# Altium schematic sheet S-COMERCIALES.SchDoc: SENSORES COMERCIALES
size A3; ApprovedBy: ---; Author: MARIO DE MIGUEL; SheetNumber: 4; SheetTotal: 7; ProjectTitle: SENSACIONAL 2
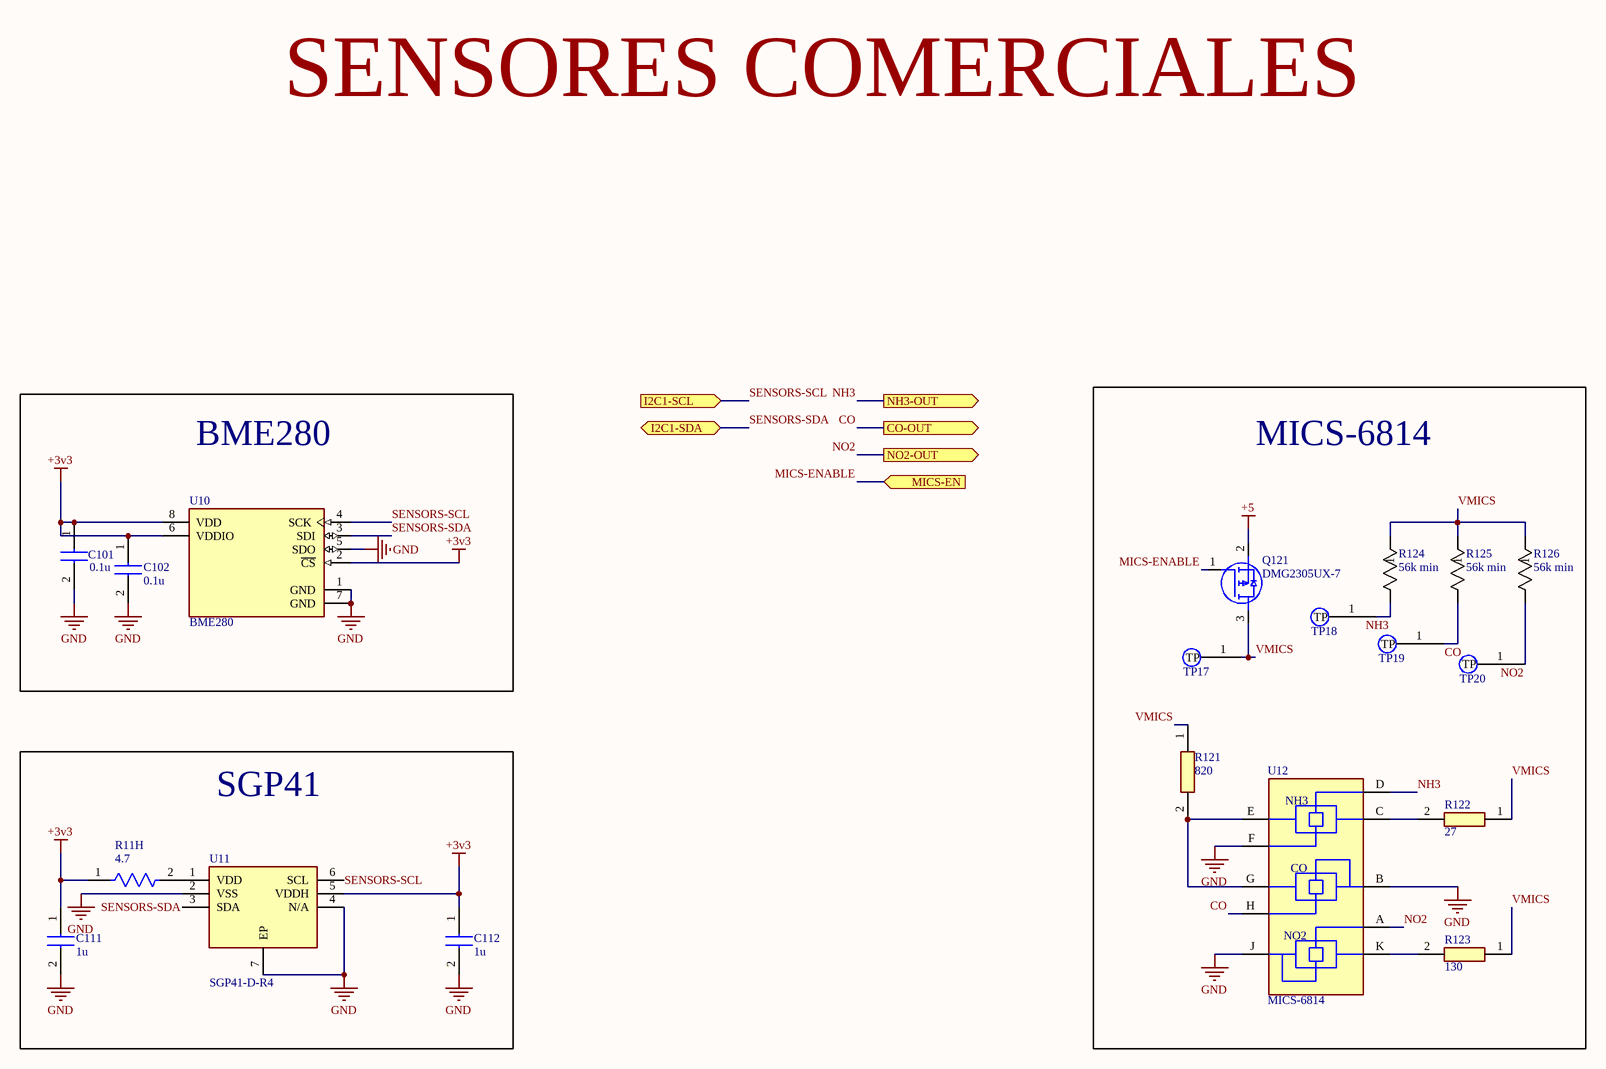
[diagram p0: S-COMERCIALES.SchDoc]

## Parts
C101  0.1u  [CAPC1005X22N]
C102  0.1u  [CAPC1005X22N]
C111  1u  [GRM15x]
C112  1u  [GRM15x]
Q121  DMG2305UX-7  [SOT96P240X115-3N]
R11H  4.7  [FP-AF0402-MFG]
R121  820  [RESC2012X70N]
R122  27  [ERJUP6]
R123  130  [ERJUP6]
R124  56k min  [RES_CFR25_6P3X2P4_YAG]  (no BOM)
R125  56k min  [RES_CFR25_6P3X2P4_YAG]  (no BOM)
R126  56k min  [RES_CFR25_6P3X2P4_YAG]  (no BOM)
TP17  Testpoint  [Testpoint_TH]  (value not drawn)  (no BOM)
TP18  Testpoint  [Testpoint_TH]  (value not drawn)  (no BOM)
TP19  Testpoint  [Testpoint_TH]  (value not drawn)  (no BOM)
TP20  Testpoint  [Testpoint_TH]  (value not drawn)  (no BOM)
U10  BME280  [FP-BME280-MFG]
U11  SGP41-D-R4  [SON80P244X244X95-7N]
U12  MICS-6814  [FP-MICS-6814-MFG]

## Blocks framed on the sheet
BME280: C101 C102 U10
MICS-6814: Q121 R121-R126 TP17-TP20 U12
SGP41: C111 C112 R11H U11

## Ports
CO-OUT (out), I2C1-SCL (in), I2C1-SDA (bidir), MICS-EN (in), NH3-OUT (out), NO2-OUT (out)

## Nets
+3v3: C101.1 C102.1 C111.1 C112.1 R11H.1 U10.2(~{CS}) U10.6(VDDIO) U10.8(VDD) U11.5(VDDH)
+5: Q121.2(S)
GND: C101.2 C102.2 C111.2 C112.2 U10.1(GND) U10.5(SDO) U10.7(GND) U11.2(VSS) U11.4(N/A) U11.7(EP) U12.B(Rh1_RED/Rs1_RED) U12.F(Rs2_NH3) U12.J(Rh1_OX/Rs1_OX)
CO: R125.2 TP19.1(TP) U12.H(Rs2_RED) ; port CO-OUT
MICS-ENABLE: Q121.1(G) ; port MICS-EN
NH3: R124.2 TP18.1(TP) U12.D(Rs1_NH3) ; port NH3-OUT
NO2: R126.2 TP20.1(TP) U12.A(Rs2) ; port NO2-OUT
SENSORS-SCL: U10.4(SCK) U11.6(SCL) ; port I2C1-SCL
SENSORS-SDA: U10.3(SDI) U11.3(SDA) ; port I2C1-SDA
VMICS: Q121.3(D) R121.1 R122.1 R123.1 R124.1 R125.1 R126.1 TP17.1(TP)
NetR11H_2: R11H.2 U11.1(VDD)
NetR121_2: R121.2 U12.E(Rh2_NH3) U12.G(Rh2_RED)
NetR122_2: R122.2 U12.C(Rh1_NH3)
NetR123_2: R123.2 U12.K(Rh2_OX)

## Notes on the sheet
- SENSORES COMERCIALES
- Title:
- Author:
- Approved:
- Size:
- Date:
- Git Hash:
- A3
- Prj:
- SW Version:
- Variant:
- Edited:
- CERN-OHL-S-2.0
- File:
- (in symbol CMP-02321-000001-1) NH3; CO; NO2

## Library data of the parts
C101 C102 = GRM152R61A104KE19D: Capacitor; Manufacturer_Name: Murata Electronics; Datasheet Link: https://search.murata.co.jp/Ceramy/image/img/A01X/G101/ENG/GRM152R61A104KE19-01A.pdf; Height: 0.22mm; Manufacturer_Part_Number: GRM152R61A104KE19D; Mouser Part Number: 81-GRM152R61A104KE9D; Mouser Price/Stock: https://www.mouser.co.uk/ProductDetail/Murata-Electronics/GRM152R61A104KE19D?qs=IPQhFcwEUOjgOs7G%2Fz457g%3D%3D; Arrow Part Number: GRM152R61A104KE19D; Arrow Price/Stock: https://www.arrow.com/en/products/grm152r61a104ke19d/murata-manufacturing
C111 C112 = GRM155C71C105ME11J: Capacitor; Manufacturer_Name: Murata Electronics; Datasheet Link: https://search.murata.co.jp/Ceramy/image/img/A01X/G101/ENG/GRM155C71C105ME11-01A.pdf; Height: 0.33mm; Manufacturer_Part_Number: GRM155C71C105ME11J
Q121 = DMG2305UX-7: MOSFET (P-Channel); Manufacturer_Name: Diodes Incorporated; Datasheet Link: https://www.diodes.com//assets/Datasheets/DMG2305UX.pdf; Height: 1.15mm; Manufacturer_Part_Number: DMG2305UX-7; Mouser Part Number: 621-DMG2305UX-7; Mouser Price/Stock: https://www.mouser.co.uk/ProductDetail/Diodes-Incorporated/DMG2305UX-7?qs=L1DZKBg7t5F%2FNBHrjfxC%252Bg%3D%3D; Arrow Part Number: DMG2305UX-7; Arrow Price/Stock: https://www.arrow.com/en/products/dmg2305ux-7/diodes-incorporated?utm_currency=USD&region=nac
R11H = CMP-03412-047171-1: Anti-Sulfurated Chip Resistors Automotive Grade 4.7Ω 1% 200ppm/°C 0402; Resistance: 4.7R; Max Power Dissipation: 63mW; Series: AF; RoHS Compliant: Yes; Case/Package: 0402; Features: Moisture Resistant; Temperature Coefficient: 200ppm/°C; Height: 0.015inch; Width: 0.02inch; Tolerance: 1%; Length: 0.039inch; Packaging: Tape and Reel; Number of Terminations: 2; Min Operating Temperature: -55°C; Resistor Type: Thick Film; Max Operating Temperature: 155°C
R121 = ERJ-T06J821V: Resistor; Manufacturer_Name: Panasonic; Datasheet Link: https://datasheet.datasheetarchive.com/originals/distributors/Datasheets_SAMA/0603a33b225a76cbfca7c0136991dc92.pdf; Height: 0.7mm; Manufacturer_Part_Number: ERJ-T06J821V; Mouser Part Number: 667-ERJ-T06J821V; Mouser Price/Stock: https://www.mouser.co.uk/ProductDetail/Panasonic/ERJ-T06J821V?qs=iIVTEDlrHA0gZpHsRdko8A%3D%3D
R122 = ERJ-UP6D27R0V: Resistor; Manufacturer_Name: Panasonic; Datasheet Link: https://industrial.panasonic.com/cdbs/www-data/pdf/RDP0000/AOA0000C337.pdf; Height: 0.7mm; Manufacturer_Part_Number: ERJ-UP6D27R0V
R123 = ERJ-UP6D1300V: Resistor; Manufacturer_Name: Panasonic; Datasheet Link: https://industrial.panasonic.com/cdbs/www-data/pdf/RDP0000/AOA0000C337.pdf; Height: 0.7mm; Manufacturer_Part_Number: ERJ-UP6D1300V
R124-R126 = CFR-25JR-52-56K: No Description Available; Manufacturer_Name: Yageo; Copyright: Copyright (C) 2025 Ultra Librarian. All rights reserved.; Manufacturer_Part_Number: CFR-25JR-52-56K
U10 = CMP-2000-05073-3: SENSOR PRESSURE HUMIDITY TEMP; Sensor Type: Temperature; Accuracy: 3%; Response Time: 1s; Output Type: SPI; Min Operating Temperature: -40°C; Max Operating Temperature: 85°C; Case/Package: LGA; Packaging: Cut Tape; Mount: Surface Mount; Lead Free: Lead Free; Number of Pins: 8
U11 = SGP41-D-R4: Integrated Circuit; Manufacturer_Name: Sensirion; Datasheet Link: https://www.sensirion.com/fileadmin/user_upload/customers/sensirion/Dokumente/9_Gas_Sensors/Datasheets/Sensirion_Gas_Sensors_Datasheet_SGP41.pdf; Height: 0.95mm; Manufacturer_Part_Number: SGP41-D-R4; Mouser Part Number: 403-SGP41-D-R4; Mouser Price/Stock: https://www.mouser.co.uk/ProductDetail/Sensirion/SGP41-D-R4?qs=A6eO%252BMLsxmRqwfOE5NYPVA%3D%3D; Arrow Part Number: SGP41-D-R4; Arrow Price/Stock: https://www.arrow.com/en/products/sgp41-d-r4/sensirion-ag?utm_currency=USD&region=nac
U12 = CMP-02321-000001-1: SMD CARBON MONOXIDE/NITROGEN DIO